# Altium schematic sheet Connectors.SchDoc
size 420 x 297 mm; SheetNumber: 5; SheetTotal: 5
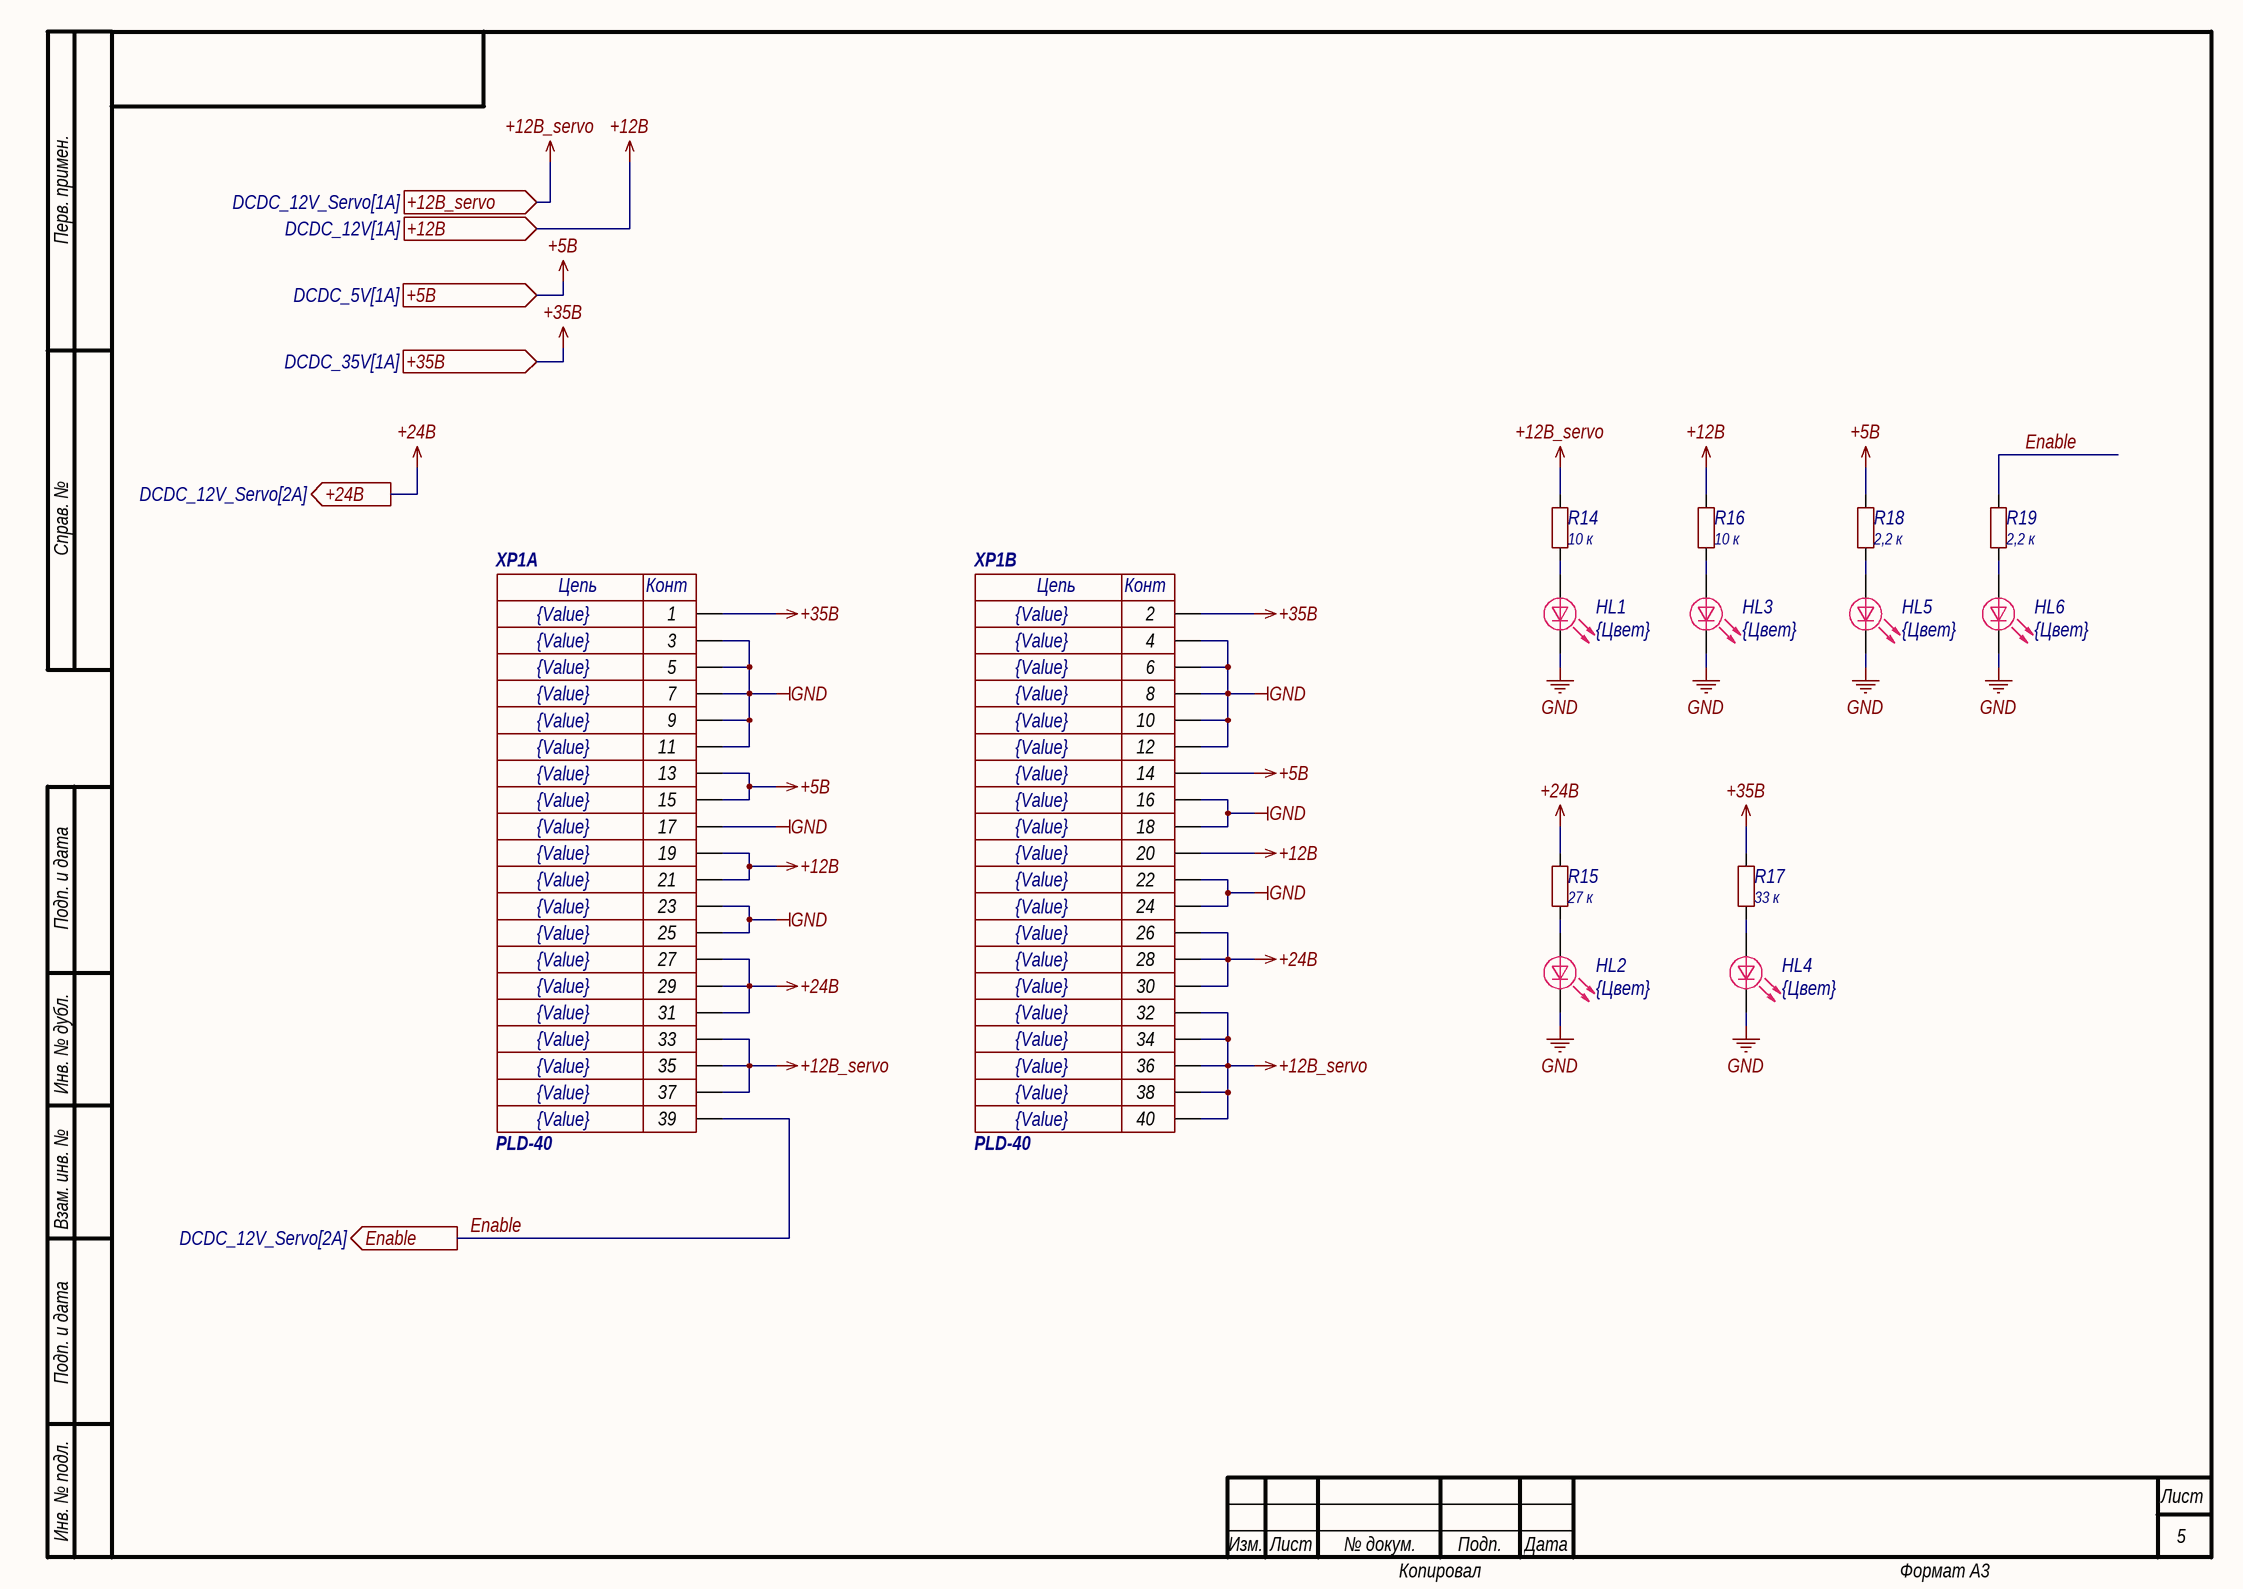
[diagram p0: Connectors.SchDoc]

## Parts
HL1  Color: {Цвет}  [0805D]  (hidden comment: LED)
HL2  Color: {Цвет}  [0805D]  (hidden comment: LED)
HL3  Color: {Цвет}  [0805D]  (hidden comment: LED)
HL4  Color: {Цвет}  [0805D]  (hidden comment: LED)
HL5  Color: {Цвет}  [0805D]  (hidden comment: LED)
HL6  Color: {Цвет}  [0805D]  (hidden comment: LED)
R14  value 10 к  [0603R]  (hidden comment: Resistor)
R15  value 27 к  [0603R]  (hidden comment: Resistor)
R16  value 10 к  [0603R]  (hidden comment: Resistor)
R17  value 33 к  [0603R]  (hidden comment: Resistor)
R18  value 2,2 к  [0603R]  (hidden comment: Resistor)
R19  value 2,2 к  [0603R]  (hidden comment: Resistor)
XP1  PLD-40  Value17: {Value}  [PLD40]  (parts A,B of 2)

## Ports
+5В (in, see DCDC_5V[1A]), +12В (in, see DCDC_12V[1A]), +12В_servo (in, see DCDC_12V_Servo[1A]), +24В (out, see DCDC_12V_Servo[2A]), +35В (in, see DCDC_35V[1A]), Enable (out, see DCDC_12V_Servo[2A])

## Nets
+5В: R18.2 XP1.13 XP1.14 XP1.15 ; port +5В
+12В: R16.2 XP1.19 XP1.20 XP1.21 ; port +12В
+12В_servo: R14.2 XP1.32 XP1.33 XP1.34 XP1.35 XP1.36 XP1.37 XP1.38 XP1.40 ; port +12В_servo
+24В: R15.2 XP1.26 XP1.27 XP1.28 XP1.29 XP1.30 XP1.31 ; port +24В
+35В: R17.2 XP1.1 XP1.2 ; port +35В
GND: HL1.2 HL2.2 HL3.2 HL4.2 HL5.2 HL6.2 XP1.3 XP1.4 XP1.5 XP1.6 XP1.7 XP1.8 XP1.9 XP1.10 XP1.11 XP1.12 XP1.16 XP1.17 XP1.18 XP1.22 XP1.23 XP1.24 XP1.25
Enable: R19.2 XP1.39 ; port Enable
NetHL1_1: HL1.1 R14.1
NetHL2_1: HL2.1 R15.1
NetHL3_1: HL3.1 R16.1
NetHL4_1: HL4.1 R17.1
NetHL5_1: HL5.1 R18.1
NetHL6_1: HL6.1 R19.1

## Notes on the sheet
- Перв. примен.
- Справ. №
- Подп. и дата
- Инв. № дубл.
- Взам. инв. №
- Инв. № подл.
- Изм.
- Лист
- № докум.
- Подп.
- Дата
- Копировал
- Формат А3
- (in symbol PLD-40, part A) Цепь; Конт
- (in symbol PLD-40, part B) Цепь; Конт

## Library data of the parts
HL1-HL6 = LED: Светодиод; Part Number: LED
R14 R16 = Resistor_10k_1_0603: Резистор номиналом 10 кОм и точностью 1%; Power: *; Part Number: Resistor_10k_1_0603; Tolerance: 1%
R15 = Resistor_27k_1_0603: Резистор номиналом 27 кОм и точностью 1%; Power: *; Part Number: Resistor_27k_1_0603; Tolerance: 1%
R17 = Resistor_33k_1_0603: Резистор номиналом 33 кОм и точностью 1%; Power: *; Part Number: Resistor_33k_1_0603; Tolerance: 1%
R18 R19 = Resistor_2.2k_1_0603: Резистор номиналом 2,2 кОм и точностью 1%; Power: *; Part Number: Resistor_2.2k_1_0603; Tolerance: 1%
XP1 = PLD-40: Гребенка 40 пинов; System: Connector; Value20: {Value}; Value19: {Value}; Value18: {Value}; Value16: {Value}; Value15: {Value}; Value14: {Value}; Value13: {Value}; Value12: {Value}; Value11: {Value}; Value10: {Value}; Value9: {Value}; Value8: {Value}; Value7: {Value}; Value6: {Value}; Value5: {Value}; Value4: {Value}; Value3: {Value}; Value2: {Value}; Value1: {Value}; Part Number: PLD-40; Datasheet: https://static.chipdip.ru/lib/177/DOC040177951.pdf